# EAGLE design microsdandportsbreakout (EAGLE 6.5.0)
dfd
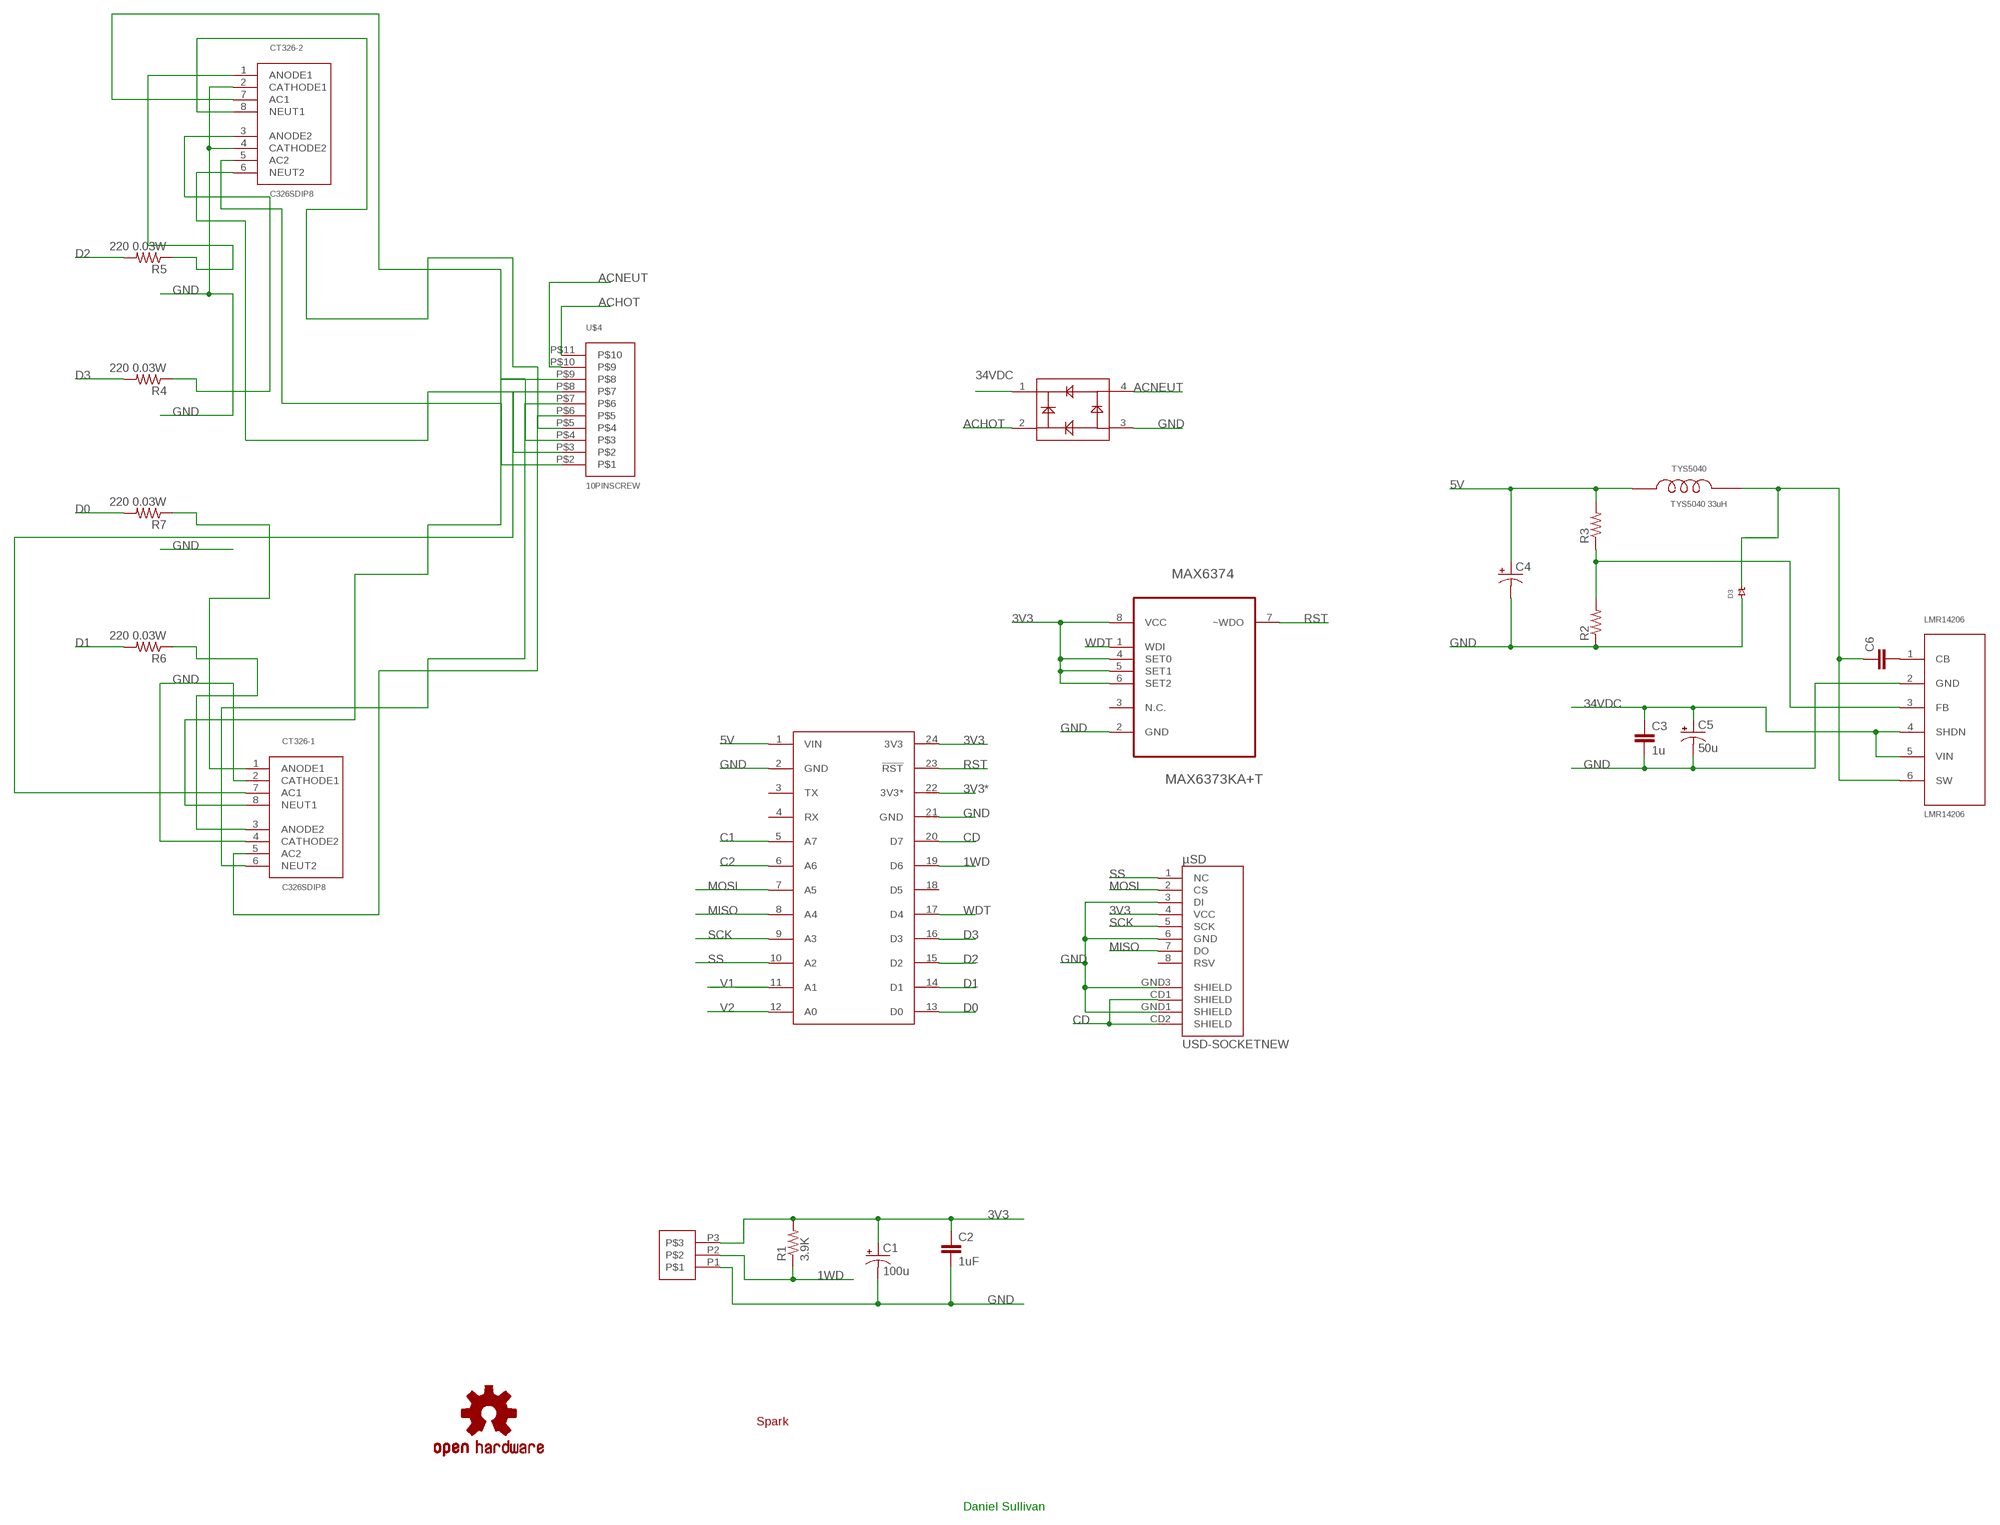
[diagram p0: schematic, sheet 1]

## Parts
BRDG  BGX50A-BRIDGE  [SOT143]
C1  100u  CAP_POLRADIAL-5MM  [CPOL-5MM-PTH]
C2  1uF  1.0PF-50V(-/+.25PF)(0603)  [0603-CAP]
C3  1u  CAP0603-CAP  [0603-CAP]
C4  CAP_POLRADIAL-5MM  [CPOL-5MM-PTH]
C5  50u  CAP_POLESK476M063AE3AA  [ESK476M063AE3AA]
C6  CAP0402-CAP  [0402-CAP]
CT326-1  C326SDIP8  [DIP08]
CT326-2  C326SDIP8  [DIP08]
D3  DIODE[SCHOTKY]-SOD123W  [SOD123W]
GND  SPARK_LOGO  [SPARK_LOGO_TSTOP]
LMR14206  LMR14206  [SOT23-6]
LOGO1  OSHW-LOGOS  [OSHW-LOGO-S]
MAX6374  MAX6373KA+T  [SOT65P280X145-8N]
R1  3.9K  3.9KOHM1/10W1%(0603)  [0603]
R2  RESISTOR0402  [0402-RES]
R3  RESISTOR0402  [0402-RES]
R4  220 0.03W  RESISTOR0603  [0603-RES]
R5  220 0.03W  RESISTOR0603  [0603-RES]
R6  220 0.03W  RESISTOR0603  [0603-RES]
R7  220 0.03W  RESISTOR0603  [0603-RES]
SPARKCORE  SPARK_CORECORE  [SPARK_CORE]
TYS5040  TYS5040 33uH  TYS5040  [LAIRD-TYS5040]
U$4  10PINSCREW  [10PIN-SCREW]
U$6  SCREW3PIN  [SCREW-3PIN]
µSD  USD-SOCKETNEW  [MICRO-SD-SOCKET-PP]

## Nets
1WD: R1.1 SPARKCORE.19(D6) U$6.P2
3V3: C1.+ C2.1 MAX6374.4(SET0) MAX6374.5(SET1) MAX6374.6(SET2) MAX6374.8(VCC) R1.2 SPARKCORE.24(3V3) U$6.P3 µSD.4(VCC)
3V3*: SPARKCORE.22(3V3*)
5V: C4.+ R3.2 SPARKCORE.1(VIN) TYS5040.P$2
11: CT326-1.5(AC2) U$4.P$6
34VDC: BRDG.1 C3.1 C5.+ LMR14206.4(SHDN) LMR14206.5(VIN)
326: CT326-2.5(AC2) U$4.P$2
352: CT326-2.7(AC1) U$4.P$4
ACHOT: BRDG.2 U$4.P$11
ACNEUT: BRDG.4 U$4.P$10
C1: SPARKCORE.5(A7)
C2: SPARKCORE.6(A6)
CD: SPARKCORE.20(D7) µSD.CD1(SHIELD) µSD.CD2(SHIELD)
D0: R7.2 SPARKCORE.13(D0)
D1: R6.2 SPARKCORE.14(D1)
D2: R5.2 SPARKCORE.15(D2)
D3: R4.2 SPARKCORE.16(D3)
FHS: CT326-1.7(AC1) U$4.P$8
GND: BRDG.3 C1.- C2.2 C3.2 C4.- C5.- CT326-1.2(CATHODE1) CT326-1.4(CATHODE2) CT326-2.2(CATHODE1) CT326-2.4(CATHODE2) D3.P$1 LMR14206.2(GND) MAX6374.2(GND) R2.1 SPARKCORE.2(GND) SPARKCORE.21(GND) U$6.P1 µSD.3(DI) µSD.6(GND) µSD.GND1(SHIELD) µSD.GND3(SHIELD)
MISO: SPARKCORE.8(A4) µSD.7(DO)
MOSI: SPARKCORE.7(A5) µSD.2(CS)
N$1: C6.2 LMR14206.1(CB)
N$6: C6.1 D3.P$2 LMR14206.6(SW) TYS5040.P$1
N$7: CT326-2.6(NEUT2) U$4.P$3
N$9: CT326-1.1(ANODE1) R7.1
N$10: CT326-1.8(NEUT1) U$4.P$9
N$11: CT326-2.3(ANODE2) R4.1
N$13: CT326-1.3(ANODE2) R6.1
N$14: LMR14206.3(FB) R2.2 R3.1
N$16: CT326-2.1(ANODE1) R5.1
N$88: CT326-2.8(NEUT1) U$4.P$5
N$99: CT326-1.6(NEUT2) U$4.P$7
RST: MAX6374.7(~WDO) SPARKCORE.23(!RST)
SCK: SPARKCORE.9(A3) µSD.5(SCK)
SS: SPARKCORE.10(A2) µSD.1(NC)
V1: SPARKCORE.11(A1)
V2: SPARKCORE.12(A0)
WDT: MAX6374.1(WDI) SPARKCORE.17(D4)
Unconnected: MAX6374.3(N.C.) SPARKCORE.3(TX) SPARKCORE.4(RX) SPARKCORE.18(D5) µSD.8(RSV)

## Notes on the sheet
- Daniel Sullivan

## Library data of the parts
BRDG = untitled:BGX50A-BRIDGE
C1 C4 C5 = untitled:CAP_POL: Capacitor Polarized These are standard SMD and PTH capacitors. Normally 10uF, 47uF, and 100uF in electrolytic and tantalum varieties. Always verify the external diameter of the through hole cap, it varies with capacity, voltage, and manufacturer. The EIA devices should be standard.
C2 = SparkFun-Capacitors:1.0PF-50V(-/+.25PF)(0603): CAP-07879; PROD_ID: CAP-07879; VALUE: 1.0pF
C3 C6 = SparkFun-Capacitors:CAP: Capacitor Standard 0603 ceramic capacitor, and 0.1" leaded capacitor.
CT326-1 CT326-2 = untitled:C326S
D3 = untitled:DIODE[SCHOTKY]
GND = Spark:SPARK_LOGO
LMR14206 = untitled:LMR14206
LOGO1 = SparkFun-Aesthetics:OSHW-LOGO: Open Source Hardware Logo This logo indicates the piece of hardware it is found on incorporates a OSHW license and/or adheres to the definition of open source hardware found here: http://freedomdefined.org/OSHW
MAX6374 = Maxim_By_element14_Batch_1:MAX6373KA+T: Pin-Selectable Watchdog Timers; MPN: MAX6373KA+T; OC_FARNELL: -; OC_NEWARK: 68K9451; PACKAGE: SOT23-8; SUPPLIER: Maxim
R1 = SparkFun-Resistors:3.9KOHM1/10W1%(0603): RES-08701; PROD_ID: RES-08701
R2 R3 = untitled:RESISTOR: Resistor Basic schematic elements and footprints for 0603, 1206, and PTH resistors.
R4-R7 = SparkFun-Resistors:RESISTOR: Resistor Basic schematic elements and footprints for 0603, 1206, and PTH resistors.
SPARKCORE = Spark:SPARK_CORE
TYS5040 = untitled:TYS5040
U$4 = untitled:10PINSCREW
U$6 = untitled:SCREW3PIN
µSD = SparkFun-Connectors:USD-SOCKET: microSD Socket Push-push type uSD socket. Schematic element and footprint production proven. Spark Fun Electronics SKU : PRT-00127. tDoc lines correctly indicate media card edge positions when inserting (unlocked, locked, depressed).

## Board
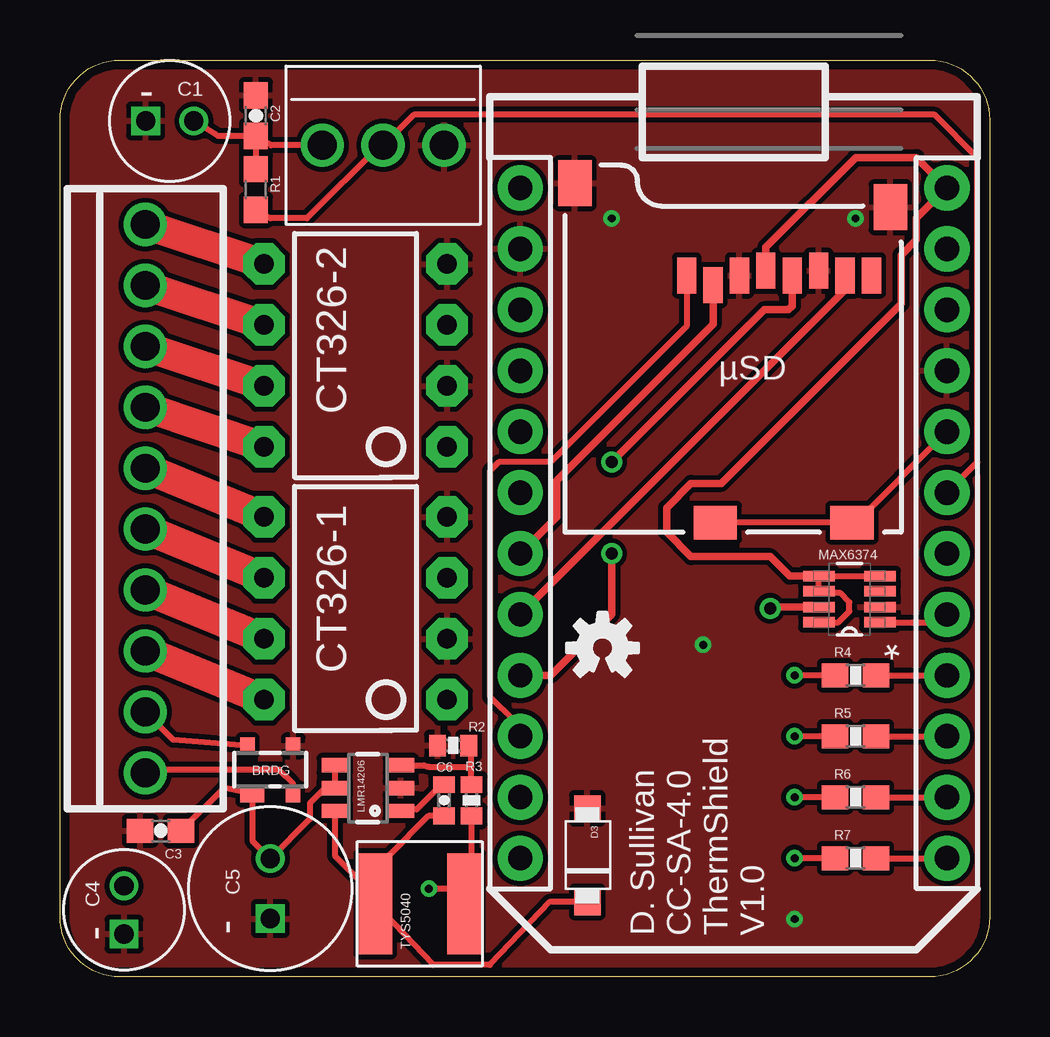
[diagram p1: board, top side]
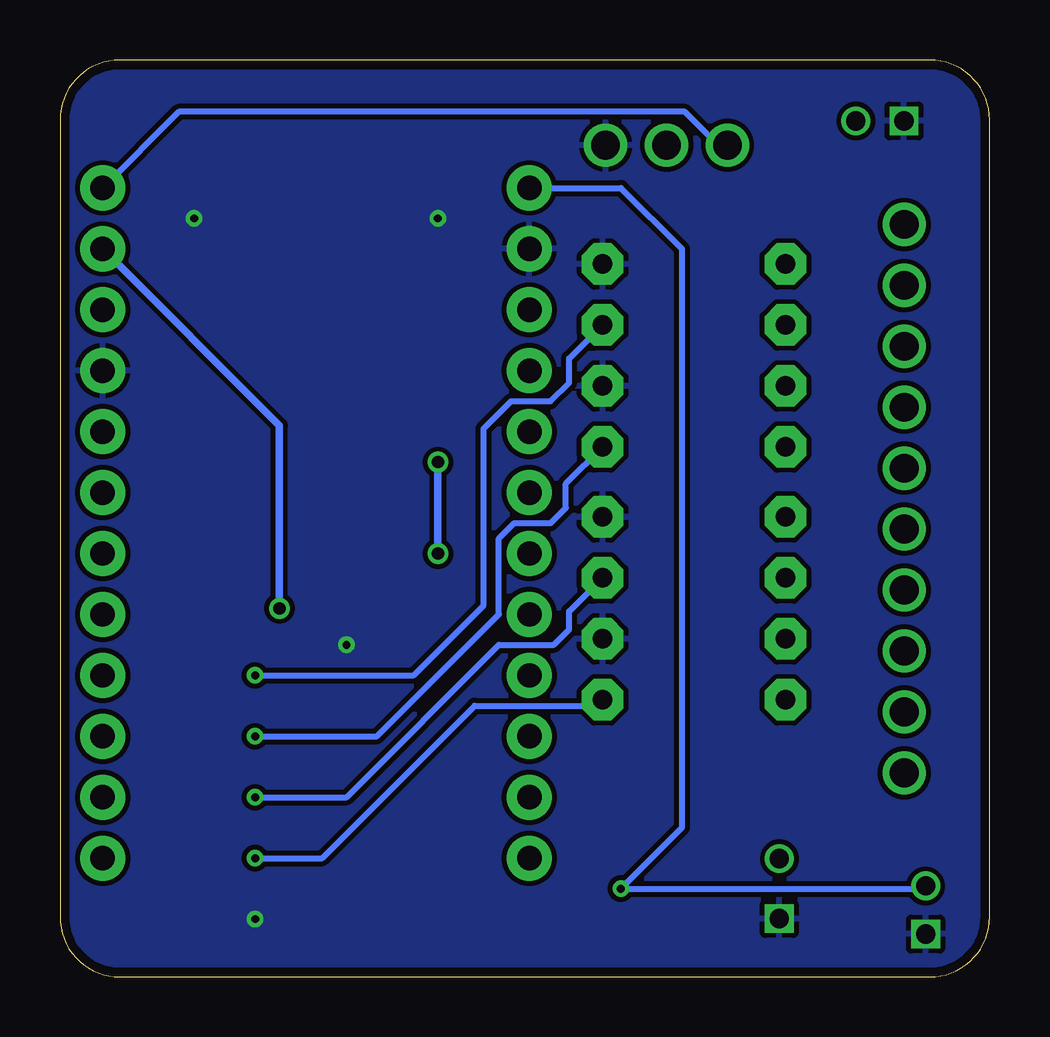
[diagram p2: board, bottom side, seen from below]

Size 38.73 x 38.23 mm. Coordinates in mm from the lower left corner, seen from the top.
Outline: 0,2.5 0,35.73 arc-90 2.5,38.23 36.23,38.23 arc-90 38.73,35.73 38.73,2.5 arc-90 36.23,0 2.5,0 arc-90 0,2.5
Copper layers (1*16): Top 0.0356mm / dielectric 1.5011mm / Bottom 0.0356mm
Design rules "LaenPCBOrder *": minimum track width 10mil, minimum drill 13mil, track to track 8mil, track to pad 8mil, pad to pad 8mil, via to via 8mil, smd to smd 8mil, copper to edge 15mil, drill to drill 8mil, minimum pad ring 7mil, minimum via ring 7mil, stop-mask expansion 3mil, vias tented up to drill 0mil, thermal gap 8mil

### Footprints (pad centres in the part's own frame; a part is rotated, then mirrored left to right if it is on the bottom)
SOT143 = smd 1 x 0.7: 1 -0.75,-1 | smd 0.6 x 0.7: 2 0.95,-1; 3 0.95,1; 4 -0.95,1
CPOL-5MM-PTH = drill 0.8: + 1.003,0 | drill 0.8 square: - -1.003,0
0603-CAP = smd 1.1 x 1: 1 -0.85,0; 2 0.85,0
ESK476M063AE3AA = drill 0.8: + 1.25,0 | drill 0.8 square: - -1.25,0
0402-CAP = smd 0.7 x 0.9: 1 -0.65,0; 2 0.65,0
DIP08 = drill 0.813 pad 1.727 octagon: 1 -3.81,-3.81; 2 -1.27,-3.81; 3 1.27,-3.81; 4 3.81,-3.81; 5 3.81,3.81; 6 1.27,3.81; 7 -1.27,3.81; 8 -3.81,3.81
SOD123W = smd 1.1 x 1.1: P$1 -1.95,0; P$2 1.95,0
SOT23-6 = smd 0.6 x 1.1: 1 -0.95,-1.375; 2 0,-1.375; 3 0.95,-1.375; 4 0.95,1.375; 5 0,1.375; 6 -0.95,1.375
SOT65P280X145-8N = smd 1.321 x 0.432: 1 -1.27,0.965; 2 -1.27,0.33; 3 -1.27,-0.33; 4 -1.27,-0.965; 5 1.27,-0.965; 6 1.27,-0.33; 7 1.27,0.33; 8 1.27,0.965
0603 = smd 1.1 x 1: 1 -0.85,0; 2 0.85,0
0402-RES = smd 0.7 x 0.9: 1 -0.65,0; 2 0.65,0
0603-RES = smd 1.1 x 1: 1 -0.85,0; 2 0.85,0
SPARK_CORE = drill 1.016 pad 1.88: 1 -8.89,13.97; 2 -8.89,11.43; 3 -8.89,8.89; 4 -8.89,6.35; 5 -8.89,3.81; 6 -8.89,1.27; 7 -8.89,-1.27; 8 -8.89,-3.81; 9 -8.89,-6.35; 10 -8.89,-8.89; 11 -8.89,-11.43; 12 -8.89,-13.97; 13 8.89,-13.97; 14 8.89,-11.43; 15 8.89,-8.89; 16 8.89,-6.35; 17 8.89,-3.81; 18 8.89,-1.27; 19 8.89,1.27; 20 8.89,3.81; 21 8.89,6.35; 22 8.89,8.89; 23 8.89,11.43; 24 8.89,13.97
LAIRD-TYS5040 = smd 1.4 x 4.2: P$1 -1.85,0; P$2 1.85,0
10PIN-SCREW = drill 1.2: P$2 -11.43,0; P$3 -8.89,0; P$4 -6.35,0; P$5 -3.81,0; P$6 -1.27,0; P$7 1.27,0; P$8 3.81,0; P$9 6.35,0; P$10 8.89,0; P$11 11.43,0
SCREW-3PIN = drill 1.2: P1 -2.54,0; P2 0,0; P3 2.54,0
MICRO-SD-SOCKET-PP = smd 0.8 x 1.5: 1 -8.94,10.7; 2 -7.84,10.3; 3 -6.74,10.7; 4 -5.64,10.9; 5 -4.54,10.7; 6 -3.44,10.9; 7 -2.34,10.7; 8 -1.24,10.7 | smd 1.8 x 1.4: CD1 -2.05,0.4; CD2 -7.75,0.4 | smd 1.4 x 1.9: GND1 -13.6,14.55; GND3 -0.45,13.55

### Placement (x,y rotation side)
BRDG  8.76,8.64 0 top
C1  4.57,35.69 0 top
C2  8.16,35.9 90 top
C3  4.19,6.1 180 top
C4  2.67,2.79 90 top
C5  8.76,3.68 90 top
C6  16,7.37 90 top
CT326-1  12.32,15.37 90 top
CT326-2  12.32,25.91 90 top
D3  21.97,5.08 270 top
GND  26.8,13.84 90 top
LMR14206  12.83,7.87 90 top
LOGO1  22.61,13.72 0 top
MAX6374  32.89,15.75 180 top
R1  8.16,32.83 90 top
R2  16.38,9.65 0 top
R3  17.14,7.37 270 top
R4  33.15,12.57 0 top
R5  33.15,10.03 0 top
R6  33.15,7.49 0 top
R7  33.15,4.95 0 top
SPARKCORE  28.07,18.92 0 top
TYS5040  14.99,3.05 0 top
U$4  3.56,19.94 270 top
U$6  13.46,34.67 180 top
µSD  35.05,18.54 0 top

### Tracks (layer width: path | path; a pad name or v marks a point on that pad's centre or on a via)
1WD
  Top 0.254: R1.1 8.77,31.62 10.29,31.62 13.34,34.67 U$6.P2 14.73,35.94 36.45,35.94 38.23,34.16 38.23,21.46 SPARKCORE.19
3V3
  Top 0.254: MAX6374.4 MAX6374.5 MAX6374.6 31.7,16 32.51,16 32.89,15.62 32.89,15.24 32.44,14.78 MAX6374.8 | C2.1 R1.2 | U$6.P3 8.8,34.67 C2.1 | C2.1 6.59,35.05 C1.+
  Top 0.305: µSD.4 29.41,30.43 33.15,34.16 35.69,34.16 SPARKCORE.24 35.69,31.62 35.69,30.73 35.05,30.1 35.05,28.07 27.56,20.57 26.29,20.57 25.27,19.56 25.27,18.54 26.29,17.53 29.59,17.53 30.4,16.71 MAX6374.5
  Bottom 0.254: U$6.P3 11.3,34.67 12.7,36.07 33.78,36.07 SPARKCORE.24
5V  (via drill 0.33 pad 0.25)
  Top 0.254: R3.2 17.14,3.86 TYS5040.P$2 16.76,3.56 16.64,3.68 v15.37,3.68
  Bottom 0.254: C4.+ 2.78,3.68 v15.37,3.68 12.83,6.22 12.83,30.35 15.37,32.89 SPARKCORE.1
11
  Top 1.27: CT326-1.5 U$4.P$6
34VDC
  Top 0.254: C3.1 6.84,7.89 BRDG.1 8.01,5.68 C5.+ 10.41,6.58 10.41,7.24 11.05,7.87 LMR14206.5 LMR14206.4
326
  Top 1.27: CT326-2.5 U$4.P$2
352
  Top 1.27: CT326-2.7 U$4.P$4
ACHOT
  Top 0.254: BRDG.2 9.71,8.07 9.14,8.64 3.68,8.64 U$4.P$11
ACNEUT
  Top 0.254: BRDG.4 4.72,9.89 U$4.P$10
CD
  Top 0.254: µSD.CD2 µSD.CD1 33,18.78 SPARKCORE.20
D0
  Top 0.254: R7.2 SPARKCORE.13
D1
  Top 0.254: R6.2 SPARKCORE.14
D2
  Top 0.254: R5.2 SPARKCORE.15
D3
  Top 0.254: R4.2 SPARKCORE.16
FHS
  Top 1.27: CT326-1.7 U$4.P$8
GND  (via drill 0.33)
  other vias: 30.61,2.41 26.8,13.84 33.15,31.62 22.99,31.62
  pour Top: 36.35,38.23 2.5,38.23 arc90 0,35.73 0,2.5 arc90 2.5,0 36.24,0 arc90 38.74,2.49 38.85,35.72 arc90
  pour Bottom: 2.51,38.23 36.36,38.23 arc-90 38.86,35.73 38.86,2.5 arc-90 36.36,0 2.62,0 arc-90 0.12,2.49 0.01,35.72 arc-90
MISO
  Top 0.305: µSD.7 32.71,28.65 SPARKCORE.8
MOSI
  Top 0.305: µSD.2 27.21,27.21 20.7,20.7 20.7,19.18 SPARKCORE.7
N$1
  Top 0.254: C6.2 15.89,8.02 14.86,6.98 14.26,6.98 LMR14206.1
N$6
  Top 0.254: LMR14206.6 11.45,5.06 12.83,3.68 13.01,3.68 TYS5040.P$1 | C6.1 15.35,6.72 13.72,5.08 13.72,4.14 TYS5040.P$1 | D3.P$2 20.4,3.13 17.91,0.51 15.55,0.51 TYS5040.P$1
N$7
  Top 1.27: CT326-2.6 U$4.P$3
N$9  (via drill 0.33 pad 0.25)
  Top 0.254: R7.1 v30.61,4.95
  Bottom 0.254: v30.61,4.95 27.81,4.95 21.46,11.3 16.38,11.3 CT326-1.1
N$10
  Top 1.27: U$4.P$9 CT326-1.8
N$11  (via drill 0.33 pad 0.25)
  Top 0.254: R4.1 v30.61,12.57
  Bottom 0.254: v30.61,12.57 24,12.57 21.08,15.49 21.08,22.86 19.94,24 18.29,24 17.53,24.77 17.53,25.78 CT326-2.3
N$13  (via drill 0.33 pad 0.25)
  Top 0.254: R6.1 v30.61,7.49
  Bottom 0.254: v30.61,7.49 26.8,7.49 20.45,13.84 18.16,13.84 17.53,14.48 17.53,15.24 CT326-1.3
N$14
  Top 0.254: R3.1 17.14,8.76 | 17.14,8.76 17.14,9.76 R2.2 | LMR14206.3 15.17,8.82 15.37,8.76 17.14,8.76
N$16  (via drill 0.33 pad 0.25)
  Top 0.254: R5.1 v30.61,10.03
  Bottom 0.254: v30.61,10.03 25.53,10.03 20.45,15.11 20.45,18.29 19.81,18.92 18.29,18.92 17.65,19.56 17.65,20.57 CT326-2.1
N$88
  Top 1.27: U$4.P$5 CT326-2.8
N$99
  Top 1.27: U$4.P$7 CT326-1.6
RST  (via drill 0.51 pad 0.25)
  Top 0.305: MAX6374.7 29.64,15.42 v29.59,15.37
  Bottom 0.305: v29.59,15.37 29.59,22.99 SPARKCORE.23
SCK  (via drill 0.51 pad 0.25)
  Top 0.305: µSD.5 30.51,27.97 30.35,27.81 29.34,27.81 v22.99,21.46 | v22.99,17.65 22.99,15.11 20.45,12.57 SPARKCORE.9
  Bottom 0.305: v22.99,21.46 v22.99,17.65
SS
  Top 0.254: µSD.1 26.11,27.13 20.45,21.46 18.29,21.46 17.91,21.08 17.91,11.68 18.92,10.67 18.92,10.29 SPARKCORE.10
WDT
  Top 0.254: MAX6374.1 36.63,14.78 SPARKCORE.17

### Text on the board
tPlace: D. Sullivan / CC-SA-4.0 / ThermShield / V1.0
bStop: Creative Commons-ShareAlike 4.0 / http://github.com/mumblepins